# EasyEDA schematic schematic.json
TITLE: Macropad; REV: 1.0; Date: 2024-06-27; Sheet: 1/1; Drawn By: Abel26; Company: -
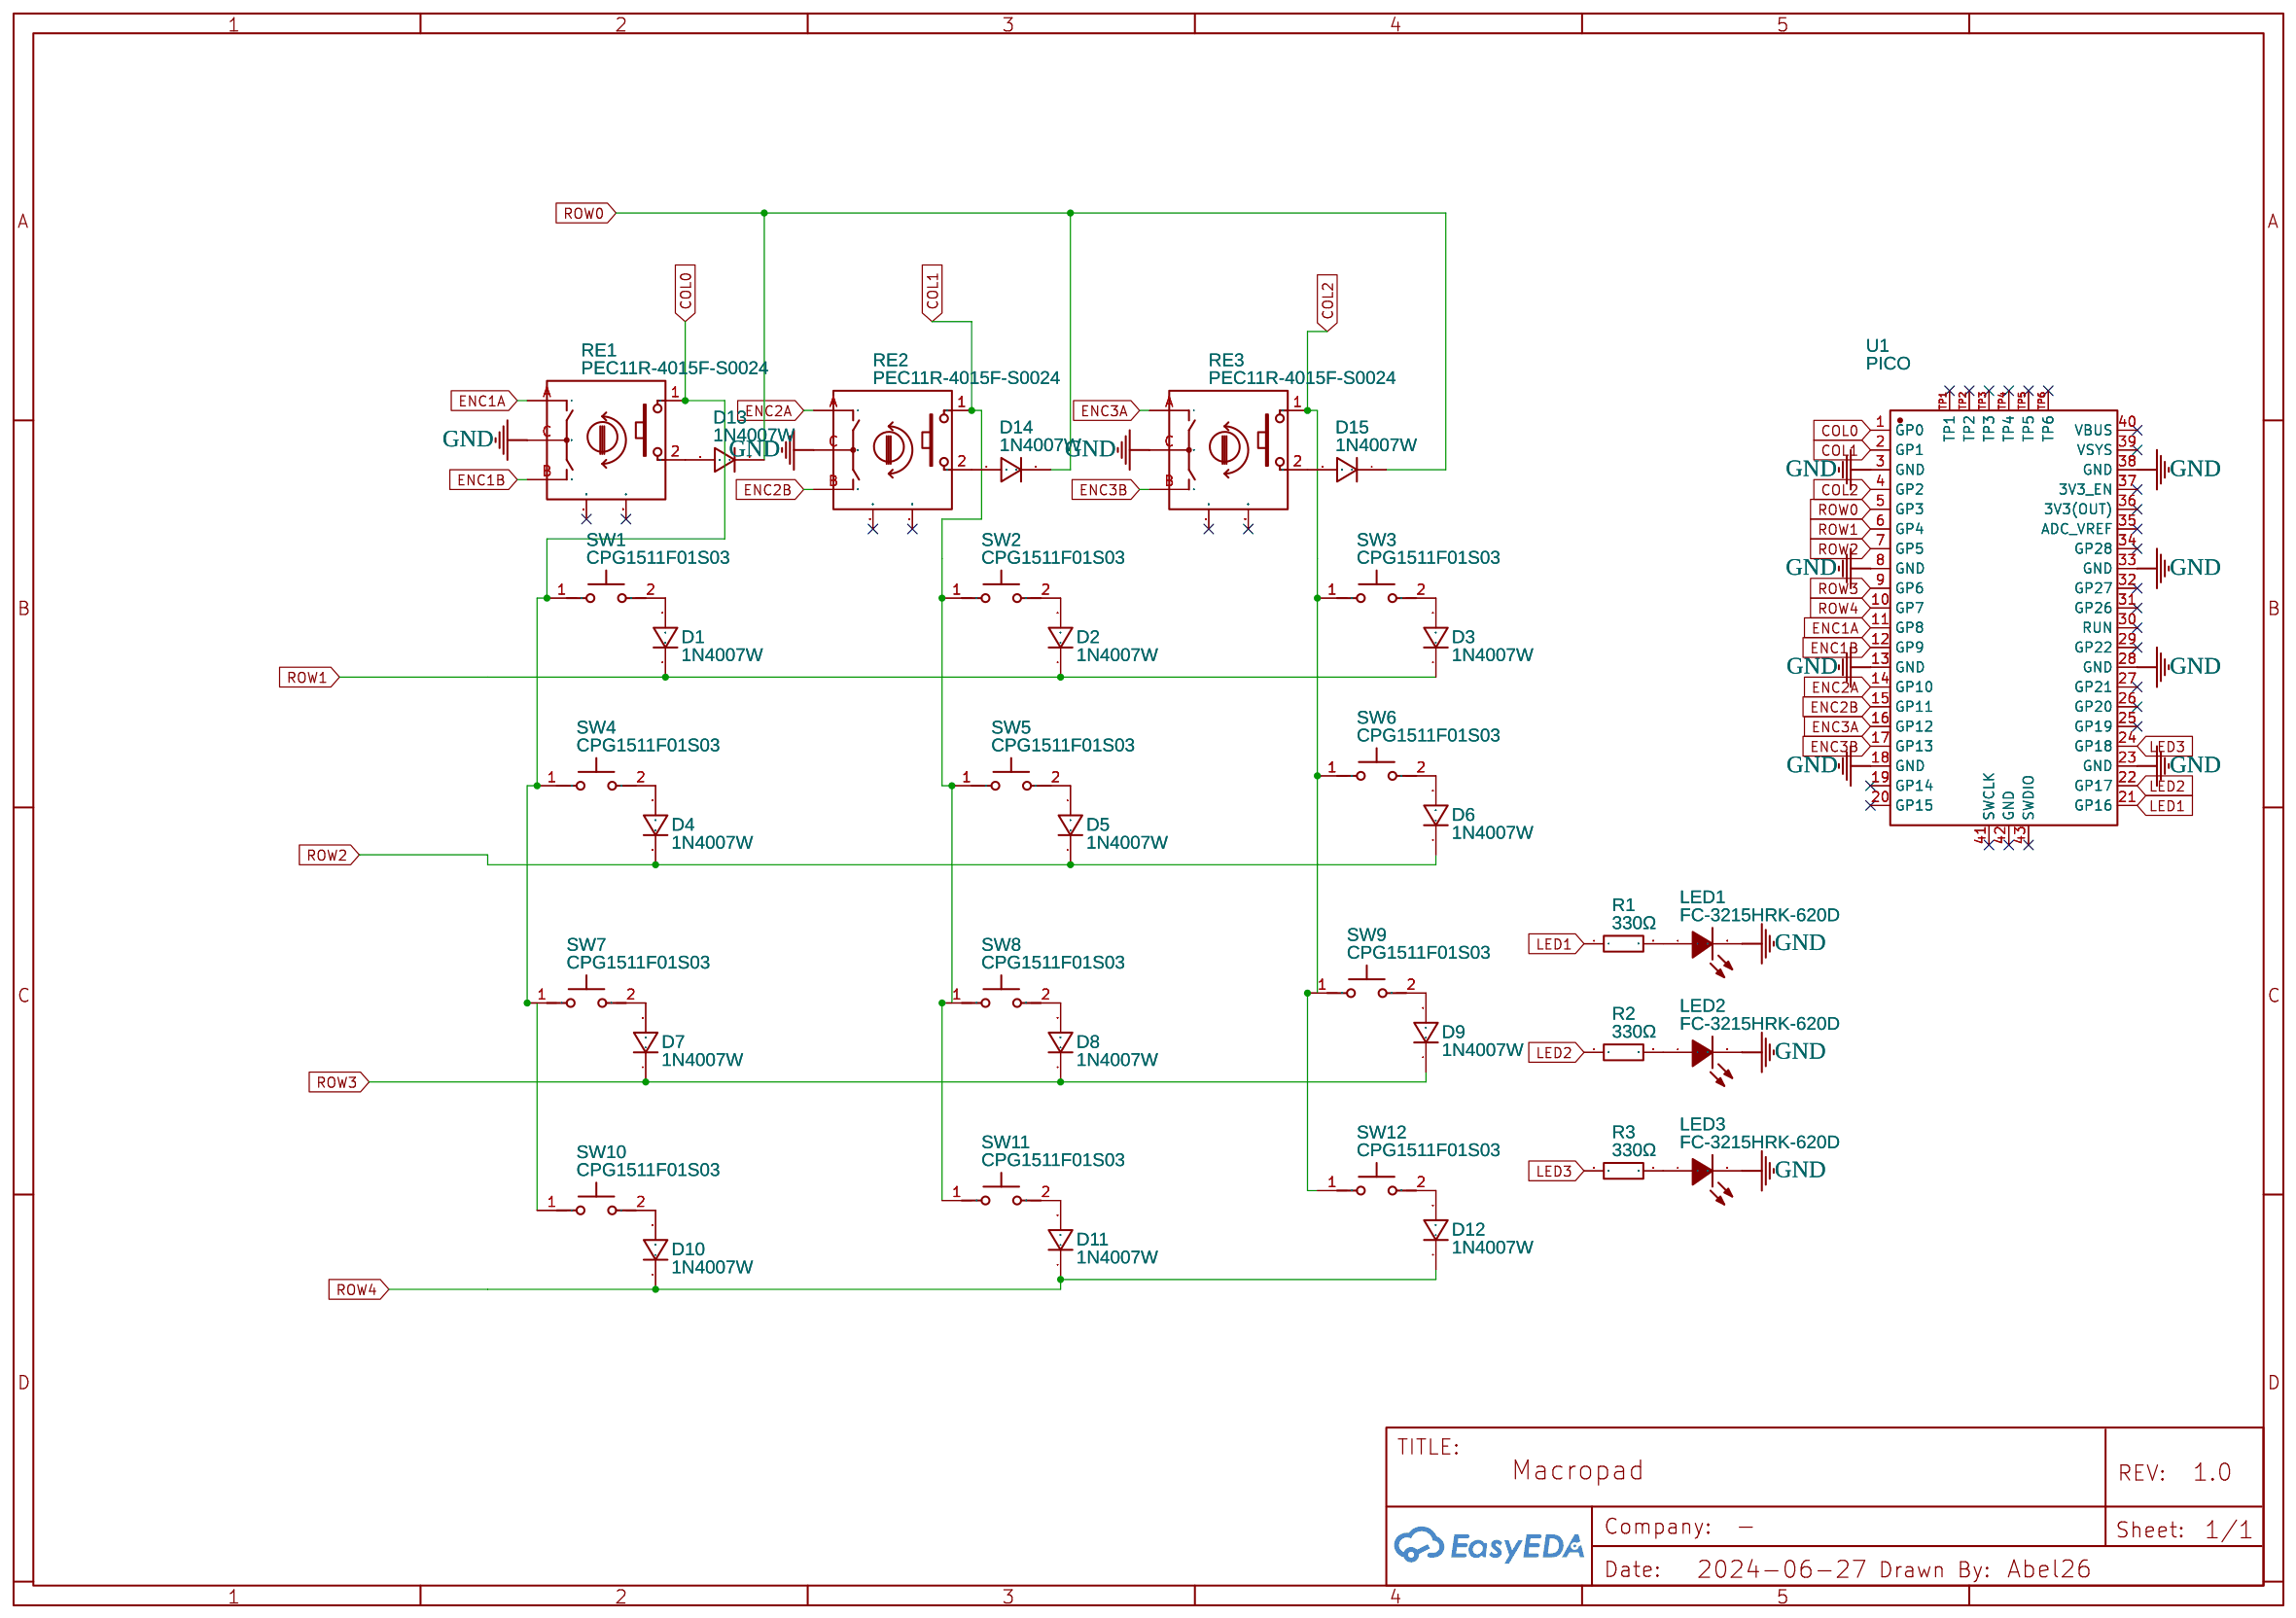
[diagram p0: schematic sheet]

## Parts
D1  1N4007W  [SOD-123_L2.8-W1.8-LS3.7-RD]
D2  1N4007W  [SOD-123_L2.8-W1.8-LS3.7-RD]
D3  1N4007W  [SOD-123_L2.8-W1.8-LS3.7-RD]
D4  1N4007W  [SOD-123_L2.8-W1.8-LS3.7-RD]
D5  1N4007W  [SOD-123_L2.8-W1.8-LS3.7-RD]
D6  1N4007W  [SOD-123_L2.8-W1.8-LS3.7-RD]
D7  1N4007W  [SOD-123_L2.8-W1.8-LS3.7-RD]
D8  1N4007W  [SOD-123_L2.8-W1.8-LS3.7-RD]
D9  1N4007W  [SOD-123_L2.8-W1.8-LS3.7-RD]
D10  1N4007W  [SOD-123_L2.8-W1.8-LS3.7-RD]
D11  1N4007W  [SOD-123_L2.8-W1.8-LS3.7-RD]
D12  1N4007W  [SOD-123_L2.8-W1.8-LS3.7-RD]
D13  1N4007W  [SOD-123_L2.8-W1.8-LS3.7-RD]
D14  1N4007W  [SOD-123_L2.8-W1.8-LS3.7-RD]
D15  1N4007W  [SOD-123_L2.8-W1.8-LS3.7-RD]
LED1  FC-3215HRK-620D  [LED1206-R-RD_RED]
LED2  FC-3215HRK-620D  [LED1206-R-RD_RED]
LED3  FC-3215HRK-620D  [LED1206-R-RD_RED]
R1  330Ω  [R0805]
R2  330Ω  [R0805]
R3  330Ω  [R0805]
RE1  PEC11R-4015F-S0024  [SW-TH_PEC11R-4XXXF-SXXXX]
RE2  PEC11R-4015F-S0024  [SW-TH_PEC11R-4XXXF-SXXXX]
RE3  PEC11R-4015F-S0024  [SW-TH_PEC11R-4XXXF-SXXXX]
SW1  CPG1511F01S03  [KEY-TH_CPG1511F01S0X]
SW2  CPG1511F01S03  [KEY-TH_CPG1511F01S0X]
SW3  CPG1511F01S03  [KEY-TH_CPG1511F01S0X]
SW4  CPG1511F01S03  [KEY-TH_CPG1511F01S0X]
SW5  CPG1511F01S03  [KEY-TH_CPG1511F01S0X]
SW6  CPG1511F01S03  [KEY-TH_CPG1511F01S0X]
SW7  CPG1511F01S03  [KEY-TH_CPG1511F01S0X]
SW8  CPG1511F01S03  [KEY-TH_CPG1511F01S0X]
SW9  CPG1511F01S03  [KEY-TH_CPG1511F01S0X]
SW10  CPG1511F01S03  [KEY-TH_CPG1511F01S0X]
SW11  CPG1511F01S03  [KEY-TH_CPG1511F01S0X]
SW12  CPG1511F01S03  [KEY-TH_CPG1511F01S0X]
U1  PICO  [COMM-SMD_L51.0-W21.0-P2.54_SC0916]

## Library data of the parts
D1-D15 = 1N4007W: Supplier: LCSC; Supplier Part: C328592; Manufacturer: BLUE ROCKET; Contributor: LCEDA_Lib
LED1-LED3 = FC-3215HRK-620D: Supplier: LCSC; Manufacturer: 国星光电; Manufacturer Part: NCD1206R1; Supplier Part: C84270; JLCPCB Part Class: Extended Part
R1-R3 = 0805W8J0331T5E: Supplier: LCSC; Manufacturer: UNI-ROYAL(厚声); Supplier Part: C25306; JLCPCB Part Class: Extended Part
RE1-RE3 = PEC11R-4015F-S0024: Contributor: LCSC; Supplier: LCSC; Supplier Part: C143789; Manufacturer: BOURNS; JLCPCB Part Class: Extended Part
SW1-SW12 = CPG1511F01S03: Contributor: LCSC; Supplier: LCSC; Supplier Part: C400227; Manufacturer: Kailh(凯华); JLCPCB Part Class: Extended Part
U1 = PICO: Supplier: LCSC; Supplier Part: C7203002; Manufacturer: Raspberry Pi(树莓派); JLCPCB Part Class: Extended Part; Contributor: lcsc

## Nets
GND: LED1.2(K) LED2.2(K) LED3.2(K) RE1.C RE2.C RE3.C U1.3(GND) U1.8(GND) U1.13(GND) U1.18(GND) U1.23(GND) U1.28(GND) U1.33(GND) U1.38(GND)
COL0: RE1.1 SW1.1 SW4.1 SW7.1 SW10.1 U1.1(GP0)
COL1: RE2.1 SW2.1 SW5.1 SW8.1 SW11.1 U1.2(GP1)
COL2: RE3.1 SW3.1 SW6.1 SW9.1 SW12.1 U1.4(GP2)
ENC1A: RE1.A U1.11(GP8)
ENC1B: RE1.B U1.12(GP9)
ENC2A: RE2.A U1.14(GP10)
ENC2B: RE2.B U1.15(GP11)
ENC3A: RE3.A U1.16(GP12)
ENC3B: RE3.B U1.17(GP13)
LED1: R1.1 U1.21(GP16)
LED2: R2.1 U1.22(GP17)
LED3: R3.1 U1.24(GP18)
ROW0: D13.1 D14.1 D15.1 U1.5(GP3)
ROW1: D1.1 D2.1 D3.1 U1.6(GP4)
ROW2: D4.1 D5.1 D6.1 U1.7(GP5)
ROW3: D7.1 D8.1 D9.1 U1.9(GP6)
ROW4: D10.1 D11.1 D12.1 U1.10(GP7)
Net-(D1-2): D1.2 SW1.2
Net-(D2-2): D2.2 SW2.2
Net-(D3-2): D3.2 SW3.2
Net-(D4-2): D4.2 SW4.2
Net-(D5-2): D5.2 SW5.2
Net-(D6-2): D6.2 SW6.2
Net-(D7-2): D7.2 SW7.2
Net-(D8-2): D8.2 SW8.2
Net-(D9-2): D9.2 SW9.2
Net-(D10-2): D10.2 SW10.2
Net-(D11-2): D11.2 SW11.2
Net-(D12-2): D12.2 SW12.2
Net-(D13-2): D13.2 RE1.2
Net-(D14-2): D14.2 RE2.2
Net-(D15-2): D15.2 RE3.2
Net-(LED1-1): LED1.1(A) R1.2
Net-(LED2-1): LED2.1(A) R2.2
Net-(LED3-1): LED3.1(A) R3.2

Not connected (* = marked no-connect by the designer): RE1 MT1* MT2*; RE2 MT1* MT2*; RE3 MT1* MT2*; U1 19(GP14)* 20(GP15)* 25(GP19)* 26(GP20)* 27(GP21)* 29(GP22)* 30(RUN)* 31(GP26)* 32(GP27)* 34(GP28)* 35(ADC_VREF)* 36(3V3(OUT))* 37(3V3_EN)* 39(VSYS)* 40(VBUS)* 41(SWCLK)* 42(GND)* 43(SWDIO)* TP1* TP2* TP3* TP4* TP5* TP6*
